# Altium project TSAL_Light_2018-2019_v2.PrjPCB
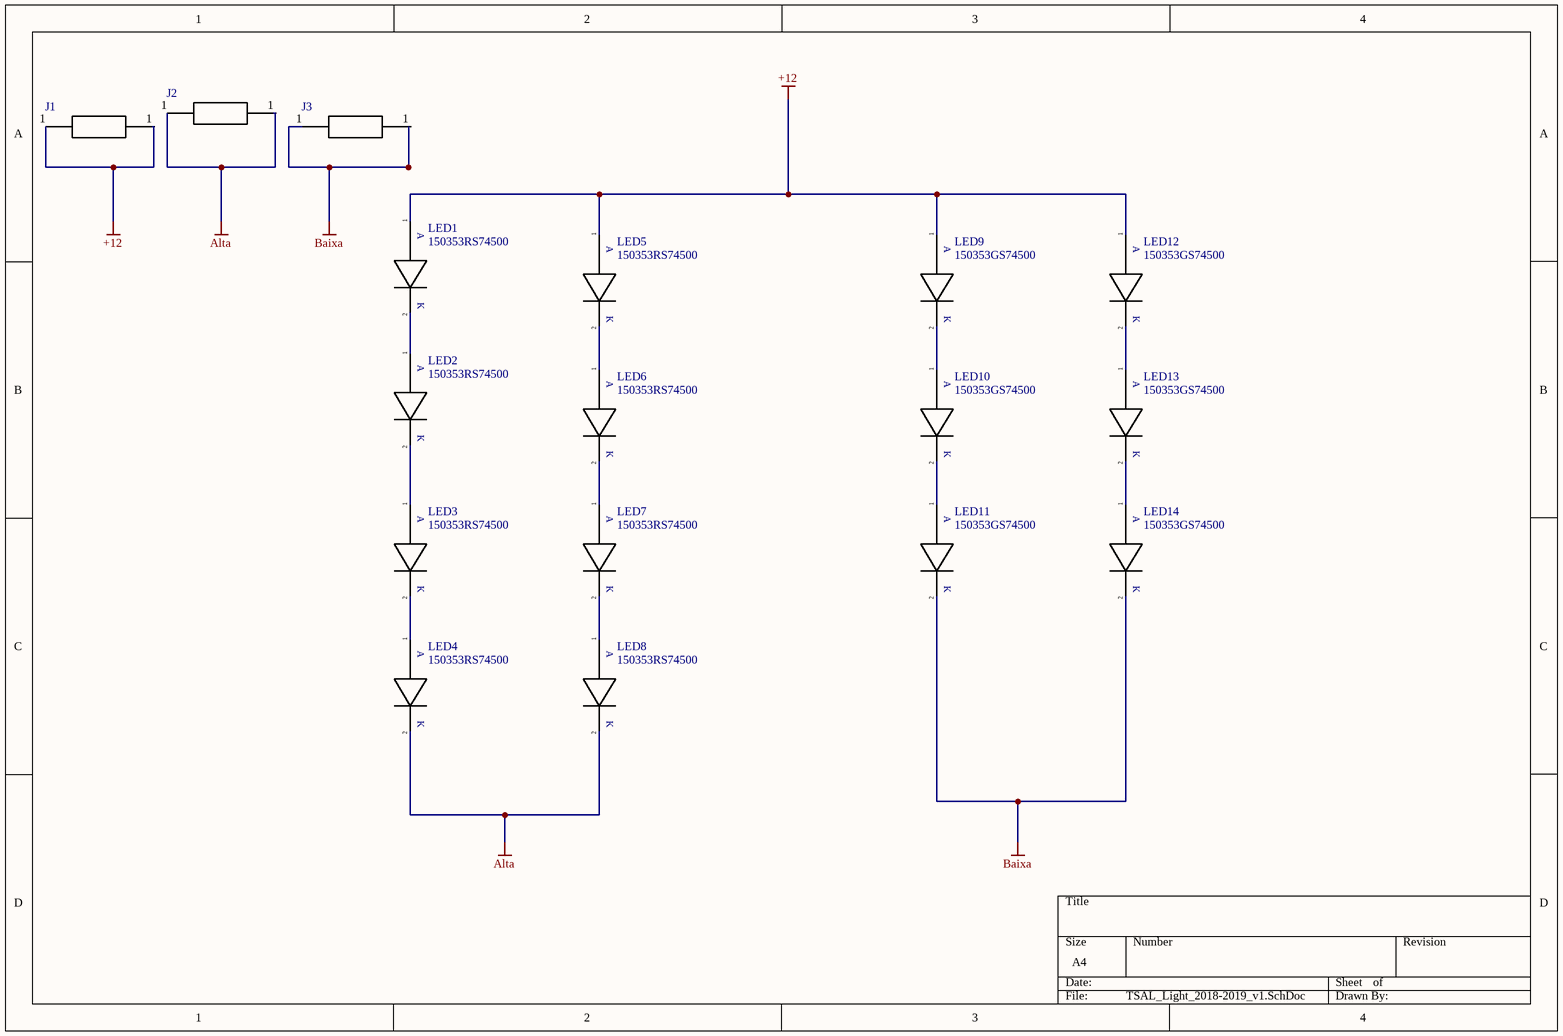
[diagram p0: TSAL_Light_2018-2019_v1.SchDoc]
1 sheet, 17 parts. Net scope: global (net labels, ports and power ports of the same name join across sheets).
Board file: TSAL_Light_2018-2019_v2.PcbDoc

## Sheet TSAL_Light_2018-2019_v1.SchDoc
size A4

### Parts
J1  Pad  [Pad]  (value not drawn)
J2  Pad  [Pad]  (value not drawn)
J3  Pad  [Pad]  (value not drawn)
LED1  150353RS74500  [150353RS74500]
LED2  150353RS74500  [150353RS74500]
LED3  150353RS74500  [150353RS74500]
LED4  150353RS74500  [150353RS74500]
LED5  150353RS74500  [150353RS74500]
LED6  150353RS74500  [150353RS74500]
LED7  150353RS74500  [150353RS74500]
LED8  150353RS74500  [150353RS74500]
LED9  150353GS74500  [150353RS74500]
LED10  150353GS74500  [150353RS74500]
LED11  150353GS74500  [150353RS74500]
LED12  150353GS74500  [150353RS74500]
LED13  150353GS74500  [150353RS74500]
LED14  150353GS74500  [150353RS74500]

### Nets
+12: J1.1 LED1.1 LED5.1 LED9.1 LED12.1
Alta: J2.1 LED4.2 LED8.2
Baixa: J3.1 LED11.2 LED14.2
NetLED1_2: LED1.2 LED2.1
NetLED2_2: LED2.2 LED3.1
NetLED3_2: LED3.2 LED4.1
NetLED5_2: LED5.2 LED6.1
NetLED6_2: LED6.2 LED7.1
NetLED7_2: LED7.2 LED8.1
NetLED9_2: LED9.2 LED10.1
NetLED10_2: LED10.2 LED11.1
NetLED12_2: LED12.2 LED13.1
NetLED13_2: LED13.2 LED14.1

### Notes on the sheet
- (in symbol 150353RS74500) A; K

### Library data of the parts
LED9-LED14 = 150353RS74500